# EAGLE design Orsini (EAGLE 6.2)
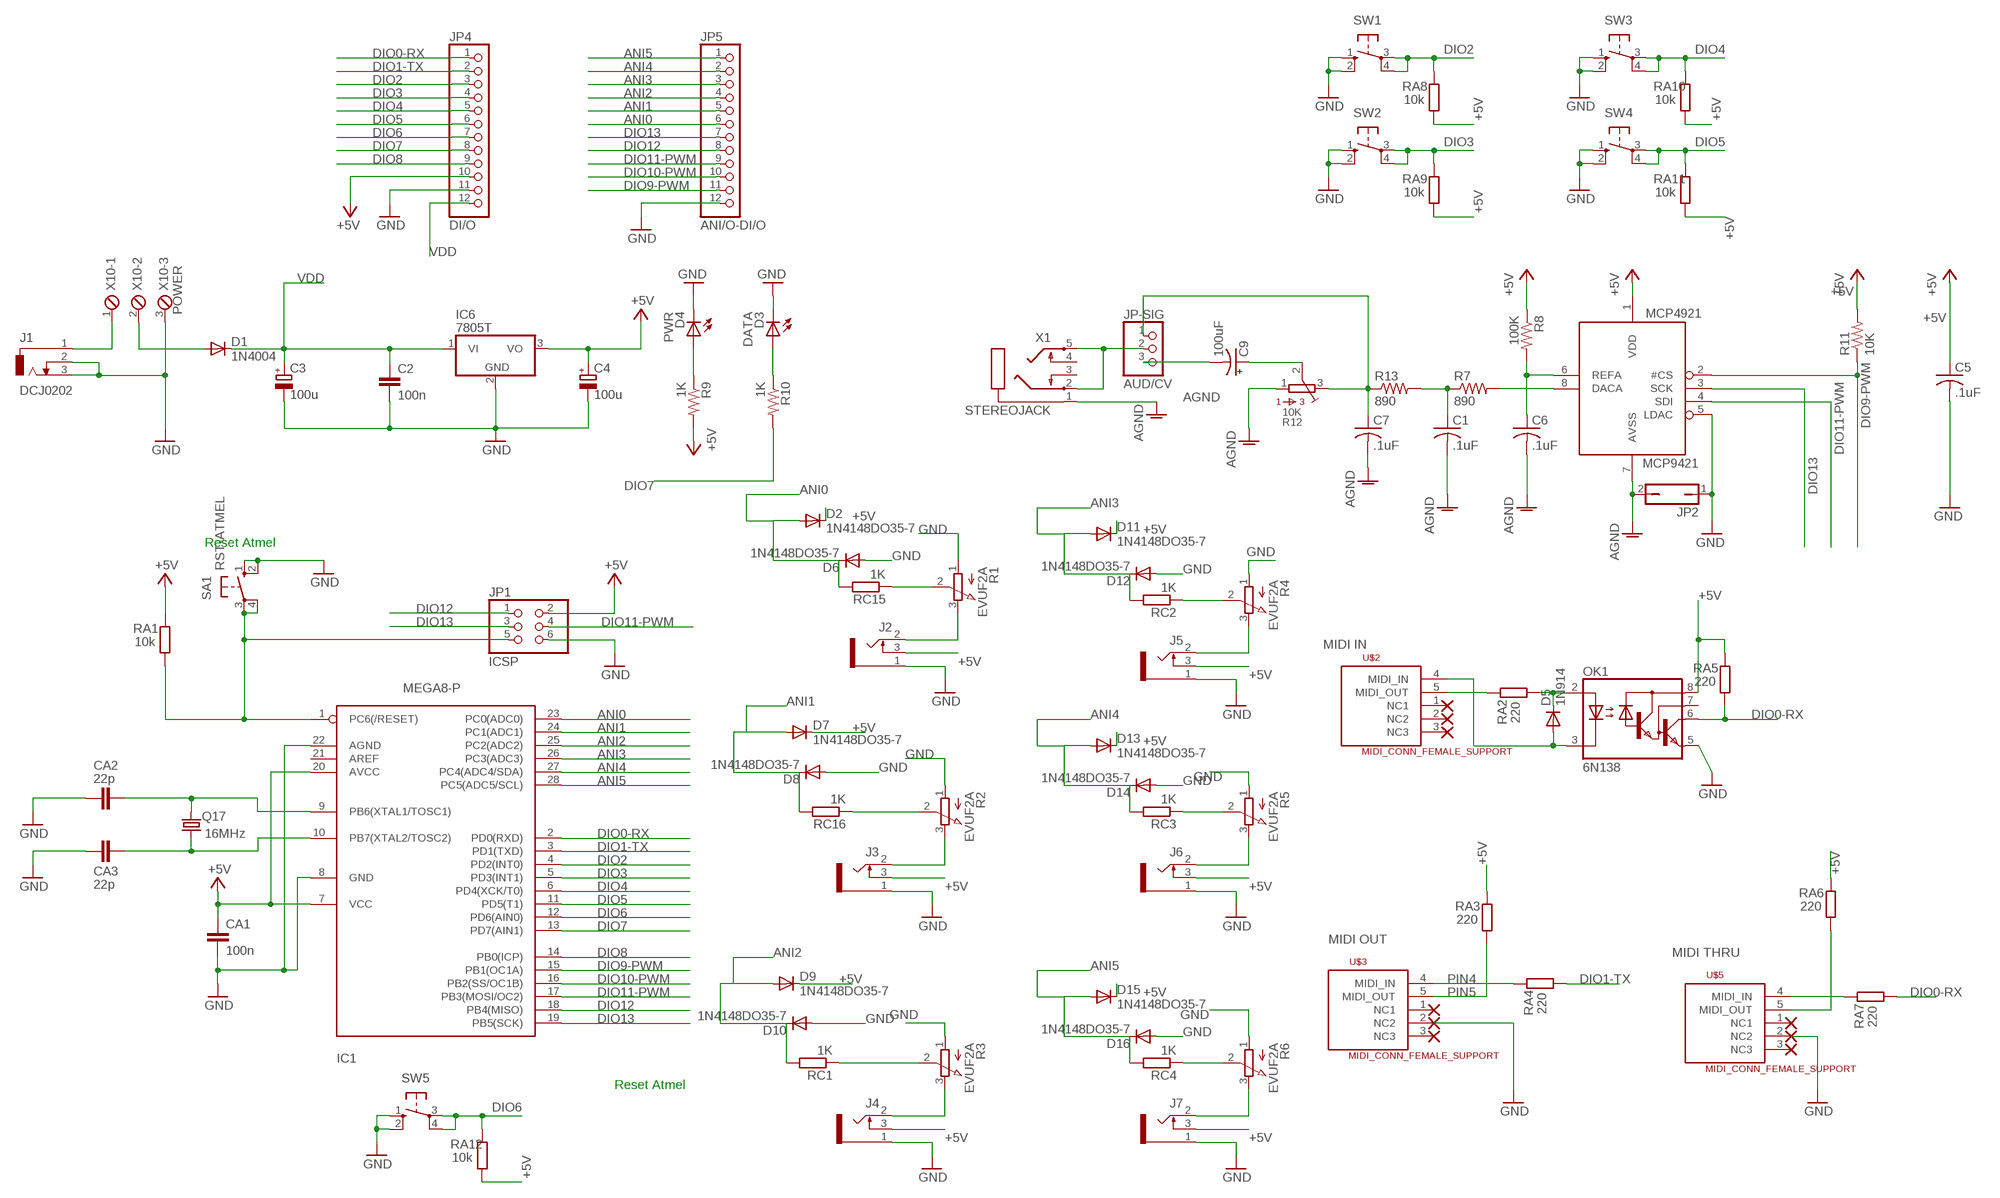
[diagram p0: schematic, sheet 1]

## Parts
C1  .1uF  C-US050-025X075  [C050-025X075]
C2  100n  C-EU050-025X075  [C050-025X075]
C3  100u  CPOL-EUE2.5-7  [E2,5-7]
C4  100u  CPOL-EUE2.5-7  [E2,5-7]
C5  .1uF  C-US025-025X050  [C025-025X050]
C6  .1uF  C-US025-025X050  [C025-025X050]
C7  .1uF  C-US050-025X075  [C050-025X075]
C9  100uF  CPOL-USE2.5-5  [E2,5-5]
CA1  100n  C-EU050-025X075  [C050-025X075]
CA2  22p  C-EU050-025X075  [C050-025X075]
CA3  22p  C-EU050-025X075  [C050-025X075]
D1  1N4004  [DO41-10]
D2  1N4148DO35-7  [DO35-7]
D3  DATA  HLMP-M  [LED4MM]
D4  PWR  HLMP-M  [LED4MM]
D5  1N914  BAS15  [DO34-7]
D6  1N4148DO35-7  [DO35-7]
D7  1N4148DO35-7  [DO35-7]
D8  1N4148DO35-7  [DO35-7]
D9  1N4148DO35-7  [DO35-7]
D10  1N4148DO35-7  [DO35-7]
D11  1N4148DO35-7  [DO35-7]
D12  1N4148DO35-7  [DO35-7]
D13  1N4148DO35-7  [DO35-7]
D14  1N4148DO35-7  [DO35-7]
D15  1N4148DO35-7  [DO35-7]
D16  1N4148DO35-7  [DO35-7]
IC1  MEGA8-P  [DIL28-3]
IC6  7805T  [TO220H]
J1  DCJ0202  [DCJ0202]
J2  1502_03SLOTTED  [1502_03_SLOTTED]
J3  1502_03SLOTTED  [1502_03_SLOTTED]
J4  1502_03SLOTTED  [1502_03_SLOTTED]
J5  1502_03SLOTTED  [1502_03_SLOTTED]
J6  1502_03SLOTTED  [1502_03_SLOTTED]
J7  1502_03SLOTTED  [1502_03_SLOTTED]
JP1  ICSP  PINHD-2X3  [2X03]
JP2  JP1Q  [JP1]
JP4  DI/O  PINHD-1X12  [1X12]
JP5  ANI/O-DI/O  PINHD-1X12  [1X12]
JP-SIG  AUD/CV  PINHD-1X3  [1X03]
MCP4921  MCP9421  [DIL08]
OK1  6N138  [DIL08]
Q17  16MHz  CRYSTALHC49S  [HC49/S]
R1  EVUF2A  [EVUF]
R2  EVUF2A  [EVUF]
R3  EVUF2A  [EVUF]
R4  EVUF2A  [EVUF]
R5  EVUF2A  [EVUF]
R6  EVUF2A  [EVUF]
R7  890  R-US_0207/7  [0207/7]
R8  100K  R-US_0207/7  [0207/7]
R9  1K  R-US_0207/7  [0207/7]
R10  1K  R-US_0207/7  [0207/7]
R11  10K  R-US_0207/10  [0207/10]
R12  10K  3386-F  [3386F]
R13  890  R-US_0207/7  [0207/7]
RA1  10k  R-EU_0207/10  [0207/10]
RA2  220  R-EU_0207/10  [0207/10]
RA3  220  R-EU_0207/10  [0207/10]
RA4  220  R-EU_0207/10  [0207/10]
RA5  220  R-EU_0207/10  [0207/10]
RA6  220  R-EU_0207/10  [0207/10]
RA7  220  R-EU_0207/10  [0207/10]
RA8  10k  R-EU_0207/10  [0207/10]
RA9  10k  R-EU_0207/10  [0207/10]
RA10  10k  R-EU_0207/10  [0207/10]
RA11  10k  R-EU_0207/10  [0207/10]
RA12  10k  R-EU_0207/10  [0207/10]
RC1  1K  R-EU_0207/10  [0207/10]
RC2  1K  R-EU_0207/10  [0207/10]
RC3  1K  R-EU_0207/10  [0207/10]
RC4  1K  R-EU_0207/10  [0207/10]
RC15  1K  R-EU_0207/10  [0207/10]
RC16  1K  R-EU_0207/10  [0207/10]
SA1  RST-ATMEL  10-XX  [B3F-10XX]
SW1  40-XX  [B3F-40XX]
SW2  40-XX  [B3F-40XX]
SW3  40-XX  [B3F-40XX]
SW4  40-XX  [B3F-40XX]
SW5  40-XX  [B3F-40XX]
U$2  MIDI_CONN_FEMALE_SUPPORT  [DIN_5_FEMALE_SUPPORT]
U$3  MIDI_CONN_FEMALE_SUPPORT  [DIN_5_FEMALE_SUPPORT]
U$5  MIDI_CONN_FEMALE_SUPPORT  [DIN_5_FEMALE_SUPPORT]
X1  STEREOJACK  [STX3001]
X10  POWER  MPT3  [3POL254]

## Nets
56: D5.C OK1.2(A) RA2.2
1235: RA3.2 U$3.5(MIDI_OUT)
+5V [Power]: C4.+ C5.1 CA1.1 D2.C D7.C D9.C D11.C D13.C D15.C IC1.7(VCC) IC1.20(AVCC) IC6.3(VO) J2.3 J3.3 J4.3 J5.3 J6.3 J7.3 JP1.2 JP4.10 MCP4921.1(VDD) OK1.8(VCC) R8.1 R9.2 R11.2 RA1.1 RA3.1 RA5.1 RA6.1 RA8.2 RA9.2 RA10.2 RA11.2 RA12.2
AGND [AGND]: C1.2 C6.2 C7.2 JP2.2 MCP4921.7(AVSS) R12.1 X1.1
ANI0: D2.A D6.C IC1.23(PC0(ADC0)) JP5.6 RC15.2
ANI1: D7.A D8.C IC1.24(PC1(ADC1)) JP5.5 RC16.2
ANI2: D9.A D10.C IC1.25(PC2(ADC2)) JP5.4 RC1.2
ANI3: D11.A D12.C IC1.26(PC3(ADC3)) JP5.3 RC2.2
ANI4: D13.A D14.C IC1.27(PC4(ADC4/SDA)) JP5.2 RC3.2
ANI5: D15.A D16.C IC1.28(PC5(ADC5/SCL)) JP5.1 RC4.2
DIO0-RX: IC1.2(PD0(RXD)) JP4.1 OK1.6(VO) RA5.2 RA7.2
DIO1-TX: IC1.3(PD1(TXD)) JP4.2 RA4.2
DIO2: IC1.4(PD2(INT0)) JP4.3 RA8.1 SW1.3(P) SW1.4(P1)
DIO3: IC1.5(PD3(INT1)) JP4.4 RA9.1 SW2.3(P) SW2.4(P1)
DIO4: IC1.6(PD4(XCK/T0)) JP4.5 RA10.1 SW3.3(P) SW3.4(P1)
DIO5: IC1.11(PD5(T1)) JP4.6 RA11.1 SW4.3(P) SW4.4(P1)
DIO6: IC1.12(PD6(AIN0)) JP4.7 RA12.1 SW5.3(P) SW5.4(P1)
DIO7: IC1.13(PD7(AIN1)) JP4.8 R10.2
DIO8: IC1.14(PB0(ICP)) JP4.9
DIO9-PWM: IC1.15(PB1(OC1A)) JP5.11 MCP4921.2(#CS) R11.1
DIO10-PWM: IC1.16(PB2(SS/OC1B)) JP5.10
DIO11-PWM: IC1.17(PB3(MOSI/OC2)) JP1.4 JP5.9 MCP4921.4(SDI)
DIO12: IC1.18(PB4(MISO)) JP1.1 JP5.8
DIO13: IC1.19(PB5(SCK)) JP1.3 JP5.7 MCP4921.3(SCK)
GND [GND]: C2.2 C3.- C4.- C5.2 CA1.2 CA2.2 CA3.2 D3.A(C) D4.A(C) D6.A D8.A D10.A D12.A D14.A D16.A IC1.8(GND) IC1.22(AGND) IC6.2(GND) J1.2 J1.3 J2.1 J3.1 J4.1 J5.1 J6.1 J7.1 JP1.6 JP2.1 JP4.11 JP5.12 MCP4921.5(LDAC) OK1.5(GND) R1.1(A) R2.1(A) R3.1(A) R4.1(A) R5.1(A) R6.1(A) SA1.1(S) SA1.2(S1) SW1.1(S) SW1.2(S1) SW2.1(S) SW2.2(S1) SW3.1(S) SW3.2(S1) SW4.1(S) SW4.2(S1) SW5.1(S) SW5.2(S1) U$3.2(NC2) U$5.2(NC2) X10.3
N$1: J1.1 X10.1
N$2: IC1.1(PC6(/RESET)) JP1.5 RA1.2 SA1.3(P) SA1.4(P1)
N$3: R1.2(S) RC15.1
N$4: D1.A X10.2
N$5: CA2.1 IC1.9(PB6(XTAL1/TOSC1)) Q17.2
N$6: CA3.1 IC1.10(PB7(XTAL2/TOSC2)) Q17.1
N$7: J2.2 R1.3(E)
N$8: RA4.1 U$3.4(MIDI_IN)
N$9: RA6.2 U$5.5(MIDI_OUT)
N$10: R2.2(S) RC16.1
N$11: J3.2 R2.3(E)
N$12: R3.2(S) RC1.1
N$13: RA7.1 U$5.4(MIDI_IN)
N$14: RA2.1 U$2.5(MIDI_OUT)
N$15: MCP4921.8(DACA) R7.2
N$16: JP-SIG.2 X1.2 X1.5
N$17: C7.1 JP-SIG.1 R12.3 R13.1
N$18: C6.1 MCP4921.6(REFA) R8.2
N$19: C1.1 R7.1 R13.2
N$20: C9.- JP-SIG.3
N$21: D3.K(A) R10.1
N$22: J4.2 R3.3(E)
N$23: R4.2(S) RC2.1
N$24: R5.2(S) RC3.1
N$25: D4.K(A) R9.1
N$26: J5.2 R4.3(E)
N$27: J6.2 R5.3(E)
N$28: J7.2 R6.3(E)
N$29: R6.2(S) RC4.1
N$42: C9.+ R12.2
PIN5: D5.A OK1.3(C) U$2.4(MIDI_IN)
VDD [Power]: C2.1 C3.+ D1.C IC6.1(VI) JP4.12
Unconnected: IC1.21(AREF) OK1.7(VB) U$2.1(NC1) U$2.2(NC2) U$2.3(NC3) U$3.1(NC1) U$3.3(NC3) U$5.1(NC1) U$5.3(NC3) X1.3 X1.4

## Notes on the sheet
- Reset Atmel
- MIDI IN
- MIDI OUT
- MIDI THRU
- PIN4
- PIN5
- Reset Atmel

## Library data of the parts
C1 C5-C7 = CMC:C-US: CAPACITOR, American symbol
C2 CA1-CA3 = rcl:C-EU: CAPACITOR, European symbol
C3 C4 = rcl:CPOL-EU: POLARIZED CAPACITOR, European symbol
C9 = rcl-ez:CPOL-US: POLARIZED CAPACITOR, American symbol
D1 = diode:1N4004: DIODE general purpose rectifier, 1 A
D2 D6-D16 = diode:1N4148: DIODE high speed (Philips)
D3 D4 = CMC:HLMP-M: 4mm Flat Top LED flat top 4mm cylinder LED, Fairchild
D5 = diode:BAS15: DIODE high speed
IC1 = atmel:MEGA8-P: MICROCONTROLLER 8 Kbytes FLASH, 1 kbytes SRAM, 512 bytes EEPROM, USART, 4-channel 10 bit ADC, 2-channel 8 bit ADC Pin compatible with Atmega48, ATMega88, ATMega168 Source: avr.lbr
IC6 = linear:78*: Positive VOLTAGE REGULATOR Source: http://cache.national.com/ds/LM/LM78L05.pdf http://www.fairchildsemi.com/ds/LM/LM7805.pdf
J1 = con-jack:DCJ0202: DC POWER JACK Source: DCJ0202.pdf
J2-J7 = og-lumberg:1502_03
JP1 = pinhead:PINHD-2X3: PIN HEADER
JP2 = jumper:JP1Q: JUMPER
JP4 JP5 = pinhead:PINHD-1X12: PIN HEADER
JP-SIG = pinhead:PINHD-1X3: PIN HEADER
MCP4921 = ashield:MCP9421
OK1 = optocoupler:6N138: MOTOROLA OPTO COUPLER; MF: VISHAY/TELEFUNKEN; MPN: 6N138; OC_FARNELL: 9860150; OC_NEWARK: 35K5294
Q17 = crystal:CRYSTAL: CRYSTAL
R1-R6 = pot:EVU: 9 mm Square Rotary Potentiometers Source: Panasonic
R7-R11 R13 = rcl-ez:R-US_: RESISTOR, American symbol
R12 = BOURNS:3386-: 3386 Series 3/8" Square Trimmer
RA1-RA12 RC1-RC4 RC15 RC16 = rcl:R-EU_: RESISTOR, European symbol
SA1 = switch-omron:10-XX: OMRON SWITCH
SW1-SW5 = og-switch:40-XX: OMRON SWITCH
U$2 U$3 U$5 = SparkFun:MIDI_CONN_FEMALE_SUPPORT
X1 = ashield:STEREOJACK: MIC/HEADPHONE JACK KS-S stereo microphone/headphone jack PG203JN (Schukat)
X10 = con-phoenix-254:MPT3: PHOENIX CONNECTOR

## Net classes
0 default: width 0.406 mm, drill 0.508 mm, clearance 0.305 mm
1 GND: width 0.61 mm, drill 0.508 mm, clearance 0.305 mm
2 Power: width 0.61 mm, drill 0.508 mm, clearance 0.305 mm
3 AGND: width 0.61 mm, drill 0.508 mm, clearance 0.305 mm

## Board
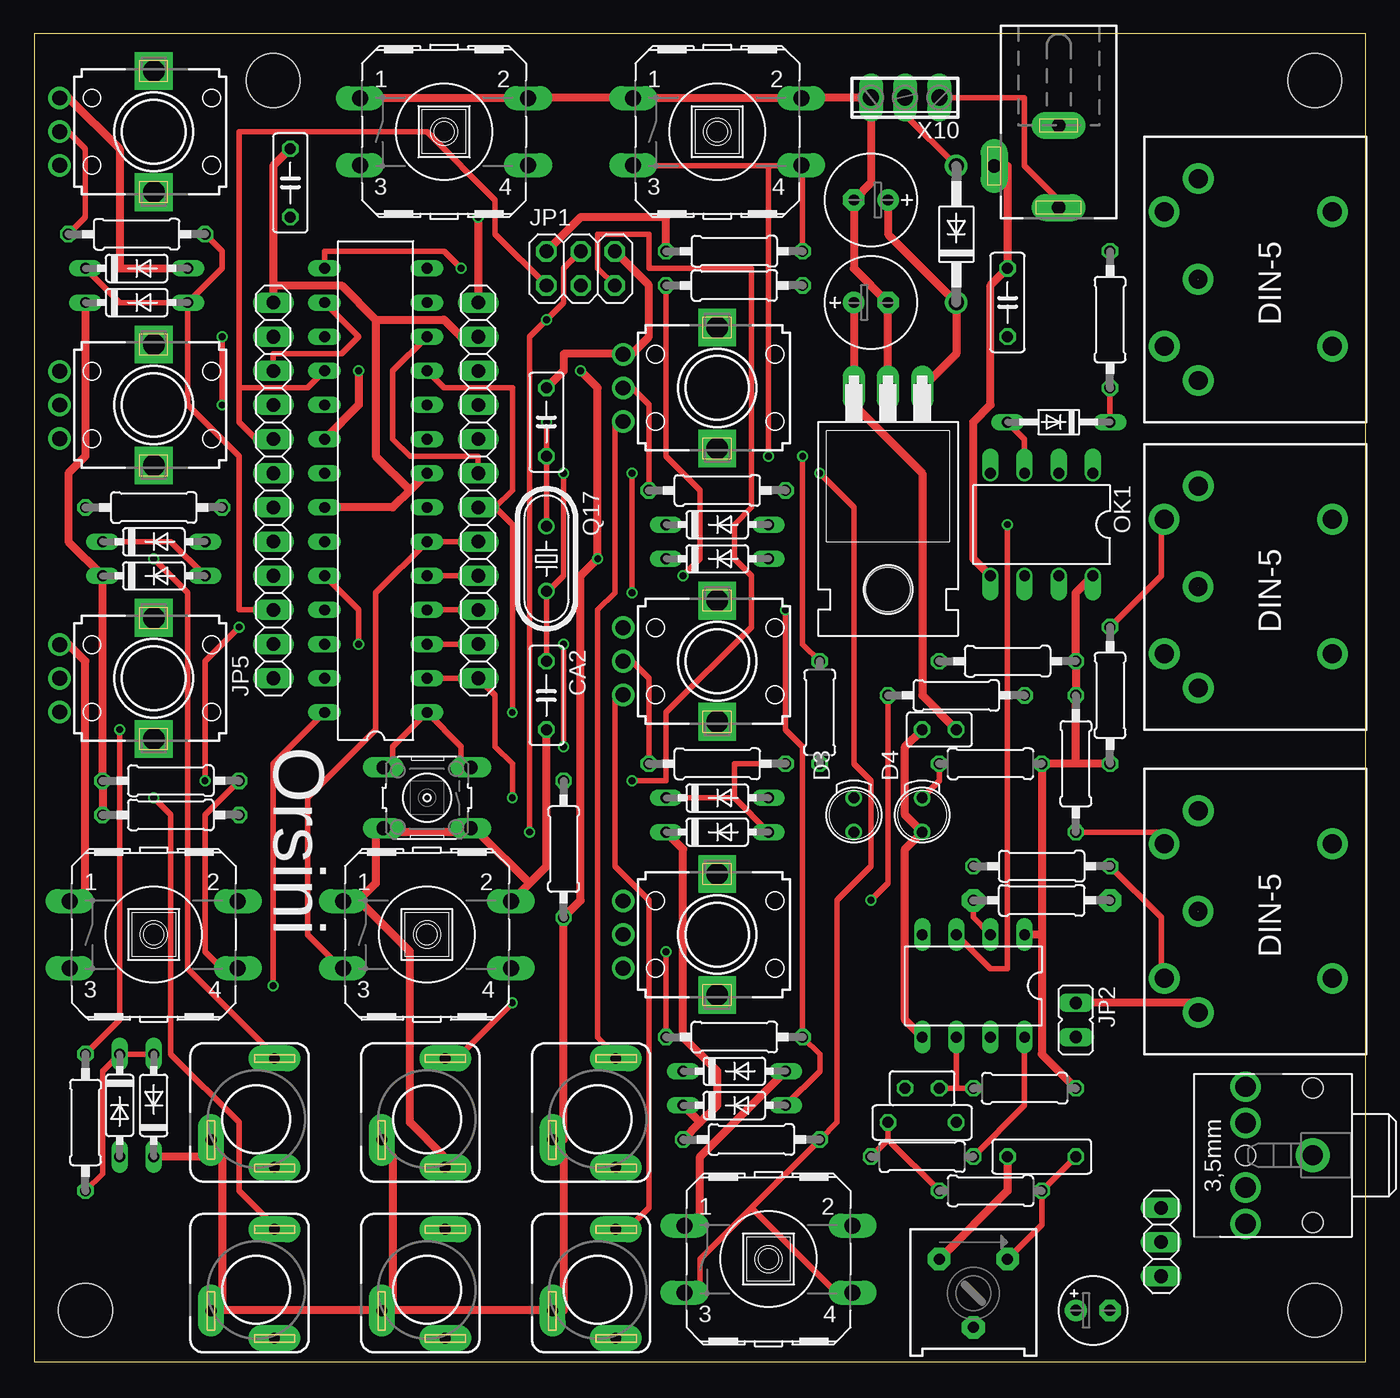
[diagram p1: board, top side]
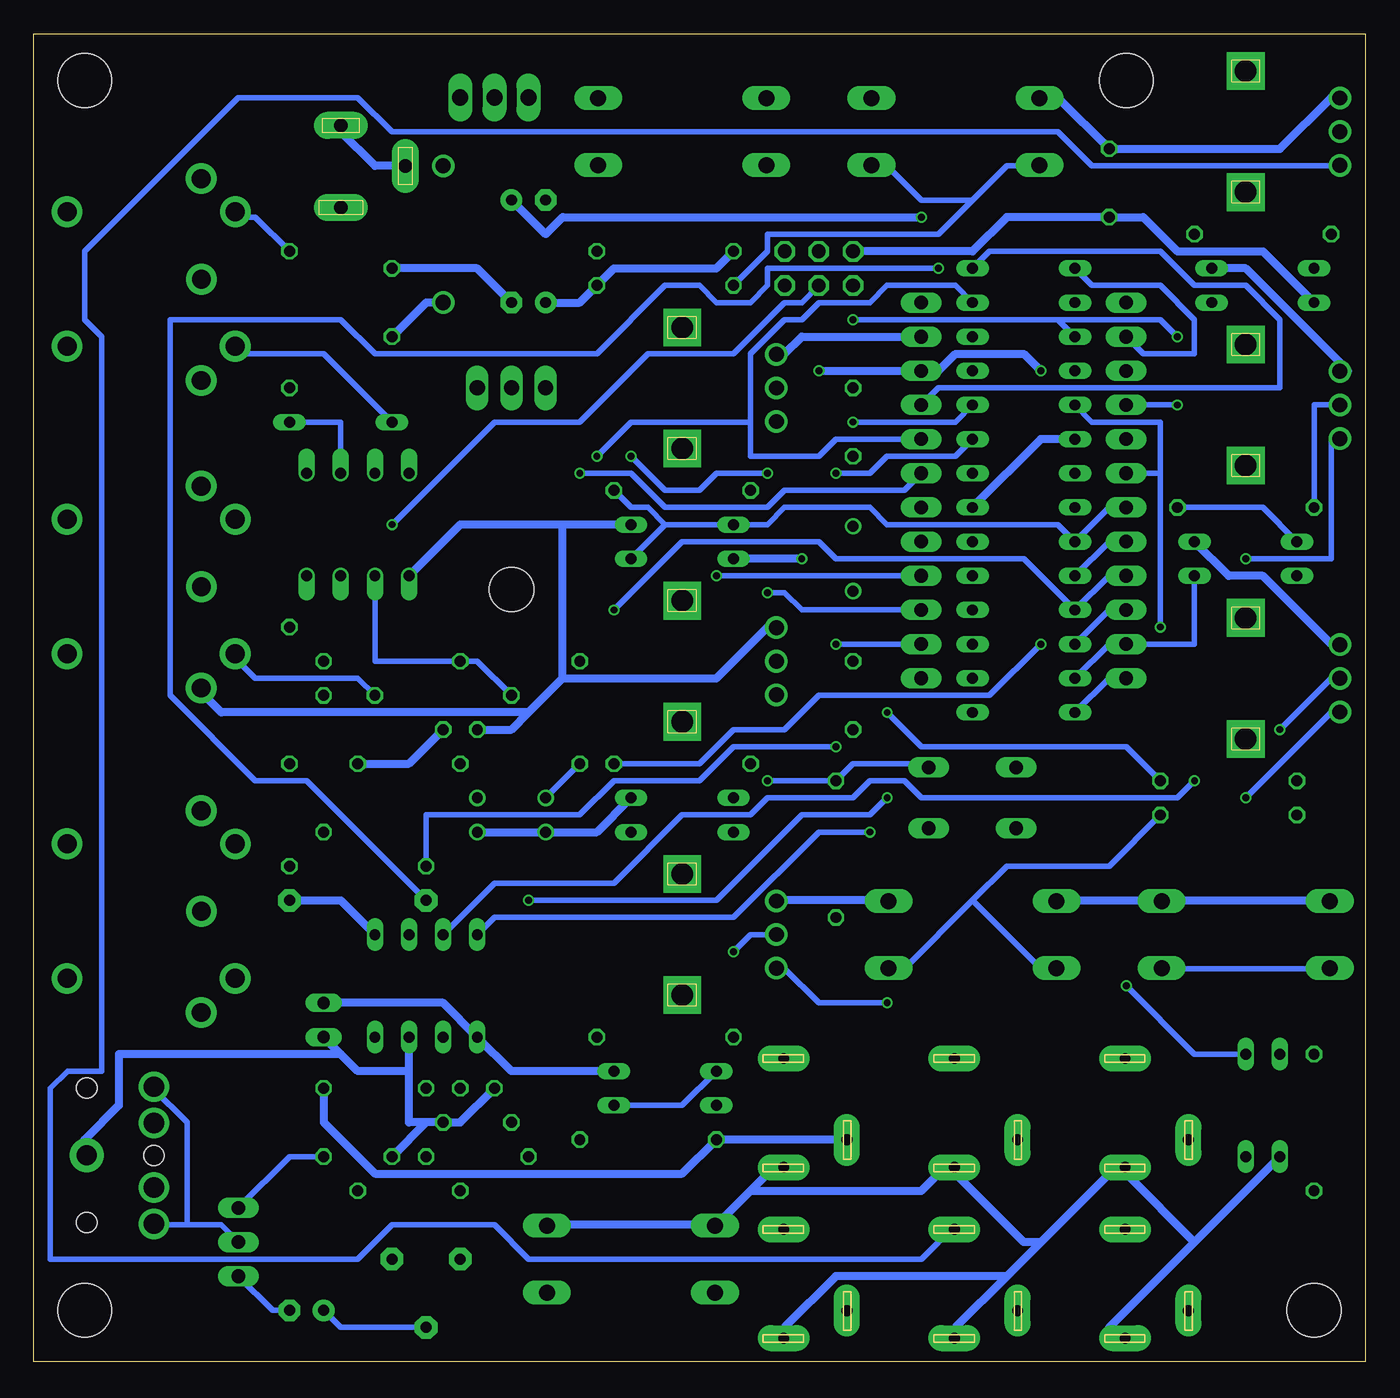
[diagram p2: board, bottom side, seen from below]

Size 99.04 x 98.73 mm. Coordinates in mm from the lower left corner, seen from the top.
Outline: 0,0 99.04,0 99.04,98.73 0,98.73 0,0
Copper layers (1*2*15*16): Top 0.035mm / dielectric 0.2mm / Route2 0.0175mm / dielectric 1.1mm / Route15 0.0175mm / dielectric 0.2mm / Bottom 0.035mm
Design rules: minimum track width 6mil, minimum drill 12mil, track to track 6mil, track to pad 6mil, pad to pad 6mil, via to via 6mil, smd to smd 0mil, copper to edge 10mil, drill to drill 10mil, minimum pad ring 6mil, minimum via ring 6mil, stop-mask expansion 2mil, vias tented up to drill 25mil, thermal gap 10mil
Holes 4 mm at 17.78,95.25 95.25,95.25 95.25,3.81 3.81,3.81

### Footprints (pad centres in the part's own frame; a part is rotated, then mirrored left to right if it is on the bottom)
C050-025X075 = drill 0.813 octagon: 1 -2.54,0; 2 2.54,0
E2,5-7 = drill 0.813 pad 1.6: + -1.27,0 | drill 0.813 pad 1.6 octagon: - 1.27,0
C025-025X050 = drill 0.813 octagon: 1 -1.27,0; 2 1.27,0
E2,5-5 = drill 0.813 pad 1.6: + -1.27,0 | drill 0.813 pad 1.6 octagon: - 1.27,0
DO41-10 = drill 1.118: A 5.08,0; C -5.08,0
DO35-7 = drill 0.813 long: A 3.81,0; C -3.81,0
LED4MM = drill 0.813: A -1.27,0; K 1.27,0
DO34-7 = drill 0.813 long: A 3.81,0; C -3.81,0
DIL28-3 = drill 0.813 long: 1 -16.51,-3.81; 2 -13.97,-3.81; 3 -11.43,-3.81; 4 -8.89,-3.81; 5 -6.35,-3.81; 6 -3.81,-3.81; 7 -1.27,-3.81; 8 1.27,-3.81; 9 3.81,-3.81; 10 6.35,-3.81; 11 8.89,-3.81; 12 11.43,-3.81; 13 13.97,-3.81; 14 16.51,-3.81; 15 16.51,3.81; 16 13.97,3.81; 17 11.43,3.81; 18 8.89,3.81; 19 6.35,3.81; 20 3.81,3.81; 21 1.27,3.81; 22 -1.27,3.81; 23 -3.81,3.81; 24 -6.35,3.81; 25 -8.89,3.81; 26 -11.43,3.81; 27 -13.97,3.81; 28 -16.51,3.81
TO220H = drill 1.118 long: 1 -2.54,-10.16; 2 0,-10.16; 3 2.54,-10.16 | hole 3.302: 0,4.826
DCJ0202 = drill 1 pad 2 long: 1 0,3.1; 2 4.8,0; 3 0,-3
1502_03_SLOTTED = drill 0.8 pad 1.93 long: 1 1.35,-3.34; 2 1.35,4.76; 3 -3.35,-1.29
2X03 = drill 1.016 octagon: 1 -2.54,-1.27; 2 -2.54,1.27; 3 0,-1.27; 4 0,1.27; 5 2.54,-1.27; 6 2.54,1.27
JP1 = drill 0.914 long: 1 0,-1.27; 2 0,1.27
1X12 = drill 1.016 long: 1 -13.97,0; 2 -11.43,0; 3 -8.89,0; 4 -6.35,0; 5 -3.81,0; 6 -1.27,0; 7 1.27,0; 8 3.81,0; 9 6.35,0; 10 8.89,0; 11 11.43,0; 12 13.97,0
1X03 = drill 1.016 long: 1 -2.54,0; 2 0,0; 3 2.54,0
DIL08 = drill 0.813 long: 1 -3.81,-3.81; 2 -1.27,-3.81; 3 1.27,-3.81; 4 3.81,-3.81; 5 3.81,3.81; 6 1.27,3.81; 7 -1.27,3.81; 8 -3.81,3.81
DIL08' = drill 0.813 offset: 1 -3.81,-3.81; 2 -1.27,-3.81; 3 1.27,-3.81; 4 3.81,-3.81; 5 3.81,3.81; 6 1.27,3.81; 7 -1.27,3.81; 8 -3.81,3.81
HC49/S = drill 0.813: 1 -2.413,0; 2 2.413,0
EVUF = drill 1.1 pad 1.676: 1 -2.5,-7; 2 0,-7; 3 2.5,-7 | drill 1.6 pad 2.8 square: M1 4.5,0; M2 -4.5,0
0207/7 = drill 0.813 octagon: 1 -3.81,0; 2 3.81,0
0207/10 = drill 0.813 pad 1.676 octagon: 1 -5.08,0; 2 5.08,0
3386F = drill 0.813 pad 1.676 octagon: 1 -2.54,2.54; 2 0,-2.54; 3 2.54,2.54
0207/10' = drill 0.813 octagon: 1 -5.08,0; 2 5.08,0
B3F-10XX = drill 1.016 long: 1 -3.251,2.261; 2 3.251,2.261; 3 -3.251,-2.261; 4 3.251,-2.261
B3F-40XX = drill 1.194 long: 1 -6.248,2.489; 2 6.248,2.489; 3 -6.248,-2.489; 4 6.248,-2.489
DIN_5_FEMALE_SUPPORT = drill 1.4 pad 2.286: 1 0.46,3.61; 2 -7.07,3.6; 3 7.94,3.6; 4 -4.53,6.12; 5 5.47,6.13; 6 -4.53,-6.382; 7 5.478,-6.382
STX3001 = drill 1.5 pad 2.54: 1 2.7,-0.1 | drill 1.5: 2 7.7,5; 3 7.7,2.3; 4 7.7,-2.5; 5 7.7,-5.2 | hole 1.5: 2.7,4.9; 2.7,-5.1; 7.7,-0.1
3POL254 = drill 1.2 long: 1 -2.54,0; 2 0,0; 3 2.54,0

### Placement (x,y rotation side)
C1  66.04,17.78 0 top
C2  72.39,78.74 90 top
C3  62.23,86.36 180 top
C4  62.23,78.74 0 top
C5  67.31,46.99 180 top
C6  66.04,20.32 180 top
C7  74.93,15.24 180 top
C9  78.74,3.81 0 top
CA1  19.05,87.63 90 top
CA2  38.1,49.53 270 top
CA3  38.1,69.85 90 top
D1  68.58,83.82 90 top
D2  50.8,59.69 0 top
D3  60.96,40.64 90 top
D4  66.04,40.64 90 top
D5  76.2,69.85 180 top
D6  50.8,62.23 0 top
D7  50.8,39.37 0 top
D8  50.8,41.91 0 top
D9  52.07,19.05 0 top
D10  52.07,21.59 0 top
D11  7.62,78.74 0 top
D12  7.62,81.28 0 top
D13  8.89,58.42 0 top
D14  8.89,60.96 0 top
D15  8.89,19.05 90 top
D16  6.35,19.05 270 top
IC1  25.4,64.77 90 top
IC6  63.5,62.23 180 top
J1  76.2,88.9 180 top
J2  41.91,17.78 0 top
J3  41.91,5.08 0 top
J4  29.21,17.78 0 top
J5  29.21,5.08 0 top
J6  16.51,17.78 0 top
J7  16.51,5.08 0 top
JP1  40.64,81.28 0 top
JP2  77.47,25.4 180 top
JP4  33.02,64.77 90 top
JP5  17.78,64.77 90 top
JP-SIG  83.82,8.89 270 top
MCP4921  69.85,27.94 180 top
OK1  6N138  [DIL08']  74.93,62.23 180 top
Q17  38.1,59.69 270 top
R1  50.8,72.39 270 top
R2  50.8,52.07 270 top
R3  50.8,31.75 270 top
R4  8.89,91.44 270 top
R5  8.89,71.12 270 top
R6  8.89,50.8 270 top
R7  66.04,15.24 0 top
R8  73.66,20.32 180 top
R9  71.12,44.45 0 top
R10  58.42,48.26 90 top
R11  74.93,34.29 0 top
R12  69.85,5.08 0 top
R13  71.12,12.7 180 top
RA1  10k  [0207/10']  39.37,38.1 90 top
RA2  220  [0207/10']  80.01,77.47 270 top
RA3  220  [0207/10']  77.47,44.45 270 top
RA4  220  [0207/10']  74.93,36.83 180 top
RA5  220  [0207/10']  72.39,52.07 180 top
RA6  220  [0207/10']  80.01,49.53 90 top
RA7  220  [0207/10']  68.58,49.53 180 top
RA8  10k  [0207/10']  52.07,82.55 180 top
RA9  10k  [0207/10']  52.07,80.01 0 top
RA10  10k  [0207/10']  10.16,40.64 180 top
RA11  10k  [0207/10']  10.16,43.18 180 top
RA12  10k  [0207/10']  53.34,16.51 180 top
RC1  1K  [0207/10']  52.07,24.13 0 top
RC2  1K  [0207/10']  7.62,83.82 0 top
RC3  1K  [0207/10']  8.89,63.5 0 top
RC4  1K  [0207/10']  3.81,17.78 270 top
RC15  1K  [0207/10']  50.8,64.77 0 top
RC16  1K  [0207/10']  50.8,44.45 0 top
SA1  29.21,41.91 180 top
SW1  50.8,91.44 0 top
SW2  30.48,91.44 0 top
SW3  29.21,31.75 0 top
SW4  8.89,31.75 0 top
SW5  54.61,7.62 0 top
U$2  90.17,80.01 90 top
U$3  90.17,33.02 90 top
U$5  90.17,57.15 90 top
X1  97.79,15.24 180 top
X10  64.77,93.98 180 top

### Tracks (layer width: path | path; a pad name or v marks a point on that pad's centre or on a via)
56
  Top 0.406: D5.C RA2.2
  Bottom 0.406: OK1.2 76.2,69.85 D5.C
1235
  Top 0.406: RA3.2 83.82,39.37 U$3.5
+5V  (via drill 0.51)
  Top 0.61: D7.C 48.26,38.1 48.26,24.13 50.8,21.59 50.8,19.05 49.53,17.78 | RA12.2 49.53,17.78 | 49.53,17.78 D9.C | D15.C 12.7,15.24 J6.3 13.97,15.24 13.97,3.81 | 26.67,3.81 26.67,15.24 J4.3 | v40.64,73.66 41.91,72.39 v41.91,59.69 40.64,58.42 40.64,34.29 RA1.1 39.37,16.51 J2.3 39.37,15.24 39.37,3.81 J3.3 38.1,3.81 26.67,3.81 | IC1.20 24.13,71.12 v24.13,73.66 | 26.67,3.81 J5.3 25.4,3.81 13.97,3.81 | 13.97,3.81 J7.3 | OK1.8 77.47,57.15 RA5.1 RA3.1 77.47,44.45 | RA6.1 77.47,44.45 | 77.47,44.45 R9.2 74.93,31.75 | R8.1 74.93,22.86 74.93,31.75 | 74.93,31.75 MCP4921.1 | JP1.2 40.64,85.09 46.99,85.09 RA8.2 | C4.+ IC6.3 60.96,71.12 66.04,66.04 66.04,49.53 C5.1 | RA10.2 RA11.2 D13.C 2.54,60.96 2.54,66.04 3.81,67.31 D11.C
  Bottom 0.61: IC1.7 24.13,68.58 IC1.20 | v41.91,59.69 D2.C | v40.64,73.66 JP4.10 31.75,73.66 30.48,74.93 25.4,74.93 v24.13,73.66 | J2.3 39.37,16.51 RA12.2 50.8,13.97 73.66,13.97 77.47,17.78 R8.1 | MCP4921.1 76.2,34.29 R11.2 | C5.1 71.12,44.45 R9.2 | C4.+ 58.42,78.74 RA9.2 55.88,81.28 48.26,81.28 RA8.2 | D11.C 7.62,82.55 13.97,82.55 16.51,85.09 CA1.1 26.67,85.09 29.21,82.55 JP1.2
AGND
  Top 0.61: R12.1 72.39,12.7 C7.2
  Bottom 0.61: 69.85,17.78 C7.2 | 69.85,17.78 C1.2 67.31,17.78 C6.2 | 71.12,21.59 71.12,17.78 69.85,17.78 | 71.12,21.59 MCP4921.7 | 76.2,22.86 74.93,21.59 71.12,21.59 | 76.2,22.86 JP2.2 | 76.2,22.86 92.71,22.86 92.71,19.05 95.25,16.51 X1.1
ANI0
  Bottom 0.406: JP5.6 19.05,63.5 IC1.23 22.86,62.23 35.56,62.23 36.83,63.5 43.18,63.5 44.45,62.23 D6.C 52.07,62.23 | 52.07,62.23 D2.A | RC15.2 54.61,63.5 53.34,63.5 52.07,62.23
ANI1  (via drill 0.51)
  Top 0.406: 52.07,41.91 D8.C | D7.A 52.07,41.91 | RC16.2 52.07,44.45 52.07,41.91 | IC1.24 24.13,55.88 v24.13,53.34
  Bottom 0.406: IC1.24 19.05,60.96 JP5.5 | v24.13,53.34 27.94,49.53 40.64,49.53 43.18,46.99 46.99,46.99 49.53,44.45 RC16.2
ANI2  (via drill 0.51)
  Top 0.406: D9.A 58.42,21.59 58.42,22.86 RC1.2 57.15,45.72 55.88,46.99 v55.88,55.88
  Bottom 0.406: JP5.4 19.05,58.42 IC1.25 25.4,59.69 39.37,59.69 40.64,60.96 50.8,60.96 v55.88,55.88 | D10.C 50.8,19.05 D9.A
ANI3
  Top 0.406: D11.A 13.97,81.28 13.97,82.55 RC2.2 | D12.C 6.35,78.74 D11.A | JP5.3 15.24,55.88 15.24,67.31 11.43,71.12 D11.A
  Bottom 0.406: IC1.26 19.05,55.88 JP5.3
ANI4
  Top 0.406: D14.C 10.16,60.96 D13.A
  Bottom 0.406: D14.C 7.62,63.5 RC3.2 | D13.A 12.7,53.34 JP5.2 19.05,53.34 IC1.27
ANI5  (via drill 0.51)
  Top 0.406: RC4.2 5.08,13.97 5.08,21.59 D16.C D15.A | IC1.28 17.78,44.45 v17.78,27.94
  Bottom 0.406: IC1.28 19.05,50.8 JP5.1 | v17.78,27.94 12.7,22.86 D15.A
DIO0-RX  (via drill 0.51)
  Top 0.406: IC1.2 JP4.1 34.29,49.53 34.29,45.72 35.56,44.45 v35.56,41.91 | v62.23,34.29 63.5,35.56 RA7.2
  Bottom 0.406: RA7.2 66.04,52.07 RA5.2 73.66,52.07 OK1.6 | v35.56,41.91 36.83,40.64 41.91,40.64 48.26,34.29 v62.23,34.29
DIO1-TX  (via drill 0.51)
  Top 0.406: v39.37,53.34 v39.37,45.72 | JP4.2 IC1.3
  Bottom 0.406: RA4.2 69.85,40.64 58.42,40.64 55.88,43.18 49.53,43.18 46.99,45.72 v39.37,45.72 | JP4.2 v39.37,53.34
DIO2  (via drill 0.51)
  Top 0.406: JP4.3 IC1.4 | RA8.1 57.15,88.9 SW1.4 55.88,88.9 54.61,88.9 | 54.61,88.9 45.72,88.9 SW1.3 | v44.45,66.04 v44.45,57.15 | 54.61,88.9 v54.61,67.31
  Bottom 0.406: JP4.3 41.91,55.88 43.18,57.15 v44.45,57.15 | v44.45,66.04 48.26,66.04 49.53,64.77 52.07,64.77 v54.61,67.31
DIO3  (via drill 0.51)
  Top 0.406: JP4.4 IC1.5 | v48.26,58.42 49.53,59.69 49.53,64.77 46.99,67.31 RA9.1
  Bottom 0.406: RA9.1 44.45,82.55 44.45,83.82 31.75,83.82 29.21,86.36 | 29.21,86.36 26.67,88.9 25.4,88.9 SW2.3 | 29.21,86.36 33.02,86.36 35.56,88.9 SW2.4 | v48.26,58.42 JP4.4
DIO4
  Top 0.406: JP4.5 IC1.6 25.4,57.15 25.4,46.99 20.32,41.91 20.32,31.75 22.86,29.21 SW3.3
  Bottom 0.406: RA10.1 19.05,36.83 26.67,36.83 29.21,34.29 | 29.21,34.29 34.29,29.21 SW3.4 | 29.21,34.29 24.13,29.21 SW3.3
DIO5  (via drill 0.51)
  Top 0.406: IC1.11 30.48,72.39 35.56,72.39 35.56,64.77 34.29,63.5 | RA11.1 12.7,40.64 12.7,30.48 13.97,29.21 SW4.4 | 34.29,63.5 35.56,62.23 v35.56,48.26 | 34.29,63.5 JP4.6
  Bottom 0.406: SW4.3 3.81,29.21 13.97,29.21 SW4.4 | v35.56,48.26 33.02,45.72 17.78,45.72 RA11.1
DIO6  (via drill 0.51)
  Top 0.406: IC1.12 26.67,73.66 26.67,68.58 27.94,67.31 33.02,67.31 JP4.7 | 53.34,11.43 49.53,7.62 49.53,5.08 SW5.3 | 53.34,11.43 RA12.1 59.69,17.78 59.69,34.29 62.23,36.83 62.23,43.18 60.96,44.45 60.96,63.5 v58.42,66.04 | 53.34,11.43 59.69,5.08 SW5.4
  Bottom 0.406: JP4.7 34.29,64.77 43.18,64.77 44.45,63.5 52.07,63.5 54.61,66.04 v58.42,66.04
DIO7  (via drill 0.51)
  Top 0.406: R10.2 57.15,53.34 v57.15,67.31
  Bottom 0.406: IC1.13 30.48,80.01 35.56,80.01 36.83,78.74 40.64,78.74 41.91,77.47 43.18,77.47 45.72,74.93 45.72,69.85 | 45.72,69.85 45.72,67.31 40.64,67.31 39.37,68.58 JP4.8 | v57.15,67.31 54.61,69.85 45.72,69.85
DIO8
  Bottom 0.406: IC1.14 27.94,82.55 15.24,82.55 12.7,80.01 8.89,80.01 6.35,77.47 6.35,72.39 31.75,72.39 JP4.9
DIO9-PWM  (via drill 0.51)
  Top 0.406: MCP4921.2 69.85,33.02 R11.1 | v31.75,81.28 30.48,82.55 21.59,82.55 IC1.15
  Bottom 0.406: IC1.15 20.32,80.01 15.24,80.01 12.7,77.47 12.7,74.93 16.51,74.93 JP5.11 | R11.1 78.74,43.18 82.55,43.18 88.9,49.53 88.9,77.47 76.2,77.47 73.66,74.93 57.15,74.93 52.07,80.01 49.53,80.01 48.26,78.74 45.72,78.74 44.45,80.01 44.45,81.28 v31.75,81.28
DIO10-PWM
  Top 0.406: IC1.16 24.13,76.2 22.86,74.93 17.78,74.93 JP5.10
DIO11-PWM  (via drill 0.51)
  Top 0.406: JP1.4 39.37,81.28 39.37,78.74 v38.1,77.47 36.83,76.2 v36.83,39.37 | v13.97,76.2 v13.97,71.12
  Bottom 0.406: 22.86,77.47 IC1.17 | v38.1,77.47 22.86,77.47 | MCP4921.4 64.77,33.02 46.99,33.02 40.64,39.37 v36.83,39.37 | v13.97,71.12 JP5.9 | v13.97,76.2 15.24,77.47 22.86,77.47
DIO12
  Top 0.406: IC1.18 20.32,72.39 15.24,72.39 | 15.24,72.39 15.24,69.85 16.51,68.58 JP5.8 | JP1.1 34.29,83.82 34.29,86.36 29.21,91.44 15.24,91.44 15.24,72.39
DIO13  (via drill 0.51)
  Top 0.406: MCP4921.3 71.12,29.21 72.39,29.21 v72.39,62.23 | v15.24,54.61 12.7,52.07 v12.7,43.18
  Bottom 0.406: IC1.19 20.32,69.85 15.24,69.85 15.24,66.04 | JP5.7 15.24,66.04 | v72.39,62.23 64.77,69.85 58.42,69.85 53.34,74.93 46.99,74.93 43.18,78.74 41.91,78.74 JP1.3 | v15.24,54.61 15.24,66.04 | v12.7,43.18 13.97,41.91 33.02,41.91 34.29,43.18 36.83,43.18 38.1,41.91 44.45,41.91 45.72,40.64 50.8,40.64 55.88,35.56 64.77,35.56 MCP4921.3
GND
  Top 0.61: J1.2 72.39,88.9 C2.2 71.12,80.01 71.12,71.12 69.85,69.85 69.85,59.69 OK1.5 | IC6.2 C4.- 60.96,81.28 C3.- 62.23,87.63 X10.3 57.15,93.98 SW1.2 55.88,93.98 45.72,93.98 SW1.1 44.45,93.98 36.83,93.98 SW2.2 35.56,93.98 25.4,93.98 SW2.1 | CA3.2 39.37,73.66 39.37,74.93 43.18,74.93 R1.1 44.45,74.93 45.72,76.2 45.72,80.01 JP1.6 | IC1.22 26.67,63.5 27.94,64.77 | IC1.8 27.94,64.77 | 17.78,80.01 17.78,88.9 CA1.2 | 17.78,80.01 JP5.12 | 27.94,64.77 25.4,67.31 25.4,77.47 | 25.4,77.47 22.86,80.01 17.78,80.01 | D12.A 6.35,81.28 6.35,90.17 2.54,93.98 R4.1 | JP4.11 31.75,76.2 30.48,77.47 25.4,77.47 | CA2.2 38.1,36.83 36.83,35.56 | 36.83,35.56 35.56,34.29 SW3.2 | 24.13,34.29 25.4,35.56 25.4,39.37 SA1.2 26.67,39.37 31.75,39.37 SA1.1 33.02,39.37 36.83,35.56 | R6.1 2.54,53.34 3.81,52.07 3.81,34.29 SW4.1 | C5.2 64.77,45.72 64.77,40.64 D4.A 64.77,38.1 64.77,25.4 MCP4921.5 | JP2.1 86.36,26.67 U$3.2 | D10.A 49.53,15.24 49.53,10.16 SW5.1 | 24.13,34.29 27.94,30.48 27.94,17.78 30.48,15.24 J4.1 | 24.13,34.29 SW3.1
  Bottom 0.61: J1.2 73.66,88.9 76.2,91.44 J1.3 | C2.2 66.04,81.28 C4.- | JP4.11 41.91,76.2 43.18,74.93 R1.1 | D12.A 8.89,81.28 1.27,73.66 R5.1 | SW2.1 24.13,93.98 22.86,93.98 CA1.2 6.35,90.17 2.54,93.98 R4.1 | R3.1 43.18,34.29 35.56,34.29 SW3.2 | D14.A 10.16,58.42 7.62,58.42 2.54,53.34 R6.1 | SW4.1 3.81,34.29 13.97,34.29 SW4.2 15.24,34.29 22.86,34.29 SW3.1 | OK1.5 67.31,62.23 59.69,62.23 | D6.A 59.69,62.23 | D4.A D3.A 57.15,39.37 D8.A | 59.69,50.8 48.26,50.8 44.45,54.61 R2.1 | 62.23,48.26 63.5,46.99 C5.2 | 62.23,48.26 59.69,50.8 | 62.23,48.26 85.09,48.26 86.36,49.53 U$5.2 | 59.69,50.8 59.69,62.23 | 12.7,8.89 19.05,2.54 J7.1 | 12.7,8.89 D16.A | 24.13,8.89 19.05,13.97 J6.1 17.78,13.97 12.7,8.89 | 24.13,8.89 26.67,6.35 | 26.67,6.35 30.48,2.54 J5.1 | 26.67,6.35 39.37,6.35 43.18,2.54 J3.1 | 24.13,8.89 25.4,8.89 30.48,13.97 J4.1 31.75,13.97 33.02,12.7 45.72,12.7 | D10.A 63.5,21.59 MCP4921.5 68.58,26.67 JP2.1 | SW5.2 59.69,10.16 49.53,10.16 SW5.1 48.26,10.16 45.72,12.7 | 45.72,12.7 44.45,13.97 J2.1
N$1
  Top 0.406: X10.1 73.66,93.98 73.66,88.9 76.2,86.36 J1.1
N$2  (via drill 0.51)
  Top 0.406: SA1.4 26.67,44.45 26.67,45.72 IC1.1 31.75,45.72 31.75,44.45 SA1.3 | JP1.5 41.91,81.28 41.91,83.82 45.72,83.82 45.72,81.28 53.34,81.28 53.34,63.5 52.07,62.23 52.07,59.69 53.34,58.42 53.34,54.61 46.99,48.26 46.99,43.18 v44.45,43.18
  Bottom 0.406: SA1.3 33.02,44.45 38.1,44.45 RA1.2 v44.45,43.18
N$3
  Top 0.406: RC15.1 45.72,71.12 44.45,72.39 R1.2
N$4
  Top 0.406: D1.A 64.77,92.71 X10.2
N$5  (via drill 0.51)
  Top 0.406: 38.1,57.15 CA2.1 | v39.37,66.04 39.37,58.42 38.1,57.15 | 38.1,57.15 Q17.2
  Bottom 0.406: IC1.9 30.48,67.31 35.56,67.31 36.83,66.04 v39.37,66.04
N$6  (via drill 0.51)
  Top 0.406: Q17.1 CA3.1 v38.1,69.85
  Bottom 0.406: IC1.10 30.48,69.85 v38.1,69.85
N$7
  Top 0.406: R1.3 43.18,69.85 43.18,57.15 41.91,55.88 41.91,24.13 43.18,22.86 J2.2
N$8
  Top 0.406: RA4.1 83.82,33.02 83.82,29.21 U$3.4
N$9
  Top 0.406: RA6.2 83.82,58.42 83.82,62.23 U$5.5
N$10
  Top 0.406: RC16.1 45.72,50.8 44.45,52.07 R2.2
N$11
  Top 0.406: R2.3 43.18,49.53 43.18,36.83 45.72,34.29 45.72,11.43 44.45,10.16 J3.2
N$12  (via drill 0.51)
  Top 0.406: v46.99,30.48 RC1.1
  Bottom 0.406: v46.99,30.48 45.72,31.75 R3.2
N$13
  Bottom 0.406: RA7.1 74.93,50.8 82.55,50.8 83.82,52.07 U$5.4
N$14
  Bottom 0.406: RA2.1 82.55,85.09 83.82,85.09 U$2.5
N$15
  Top 0.406: R7.2 73.66,19.05 MCP4921.8
N$16
  Bottom 0.406: JP-SIG.2 85.09,10.16 87.63,10.16 | 87.63,10.16 90.17,10.16 X1.2 | 87.63,10.16 87.63,17.78 90.17,20.32 X1.5
N$17
  Top 0.406: C7.1 R13.1 74.93,10.16 R12.3
  Bottom 0.406: JP-SIG.1 80.01,15.24 C7.1
N$18
  Top 0.406: R8.2 68.58,20.32 | 68.58,20.32 C6.1 | 68.58,20.32 MCP4921.6
N$19
  Top 0.406: 63.5,16.51 R7.1 | C1.1 63.5,16.51 | 63.5,16.51 R13.2
N$20
  Bottom 0.406: JP-SIG.3 81.28,3.81 C9.-
N$21
  Bottom 0.406: R10.1 D3.K
N$22  (via drill 0.51)
  Top 0.406: v35.56,26.67 31.75,22.86 J4.2
  Bottom 0.406: v35.56,26.67 40.64,26.67 43.18,29.21 R3.3
N$23
  Top 0.406: RC2.1 3.81,85.09 3.81,90.17 2.54,91.44 R4.2
N$24
  Bottom 0.406: RC3.1 3.81,71.12 R5.2
N$25
  Top 0.406: D4.K 67.31,43.18 R9.1
N$26
  Bottom 0.406: R4.3 2.54,88.9 20.32,88.9 22.86,91.44 72.39,91.44 74.93,93.98 83.82,93.98 95.25,82.55 95.25,77.47 93.98,76.2 93.98,21.59 96.52,21.59 97.79,20.32 97.79,7.62 74.93,7.62 72.39,10.16 64.77,10.16 62.23,7.62 33.02,7.62 31.75,8.89 J5.2
N$27  (via drill 0.51)
  Top 0.406: v8.89,59.69 11.43,57.15 11.43,29.21 17.78,22.86 J6.2
  Bottom 0.406: v8.89,59.69 2.54,59.69 2.54,68.58 R5.3
N$28  (via drill 0.51)
  Top 0.406: v8.89,41.91 10.16,40.64 10.16,22.86 15.24,17.78 15.24,12.7 17.78,10.16 J7.2
  Bottom 0.406: v8.89,41.91 2.54,48.26 R6.3
N$29  (via drill 0.51)
  Top 0.406: RC4.1 6.35,25.4 v6.35,46.99
  Bottom 0.406: v6.35,46.99 2.54,50.8 R6.2
N$42
  Bottom 0.406: C9.+ 76.2,2.54 R12.2
PIN5
  Top 0.406: D5.A 73.66,68.58 OK1.3
  Bottom 0.406: D5.A 77.47,74.93 83.82,74.93 U$2.4
VDD  (via drill 0.51)
  Top 0.61: IC6.1 68.58,74.93 D1.C 63.5,83.82 C3.+ | v33.02,85.09 JP4.12
  Bottom 0.61: C2.1 69.85,78.74 D1.C | v33.02,85.09 59.69,85.09 60.96,83.82 C3.+

### Text on the board
tNames: Orsini